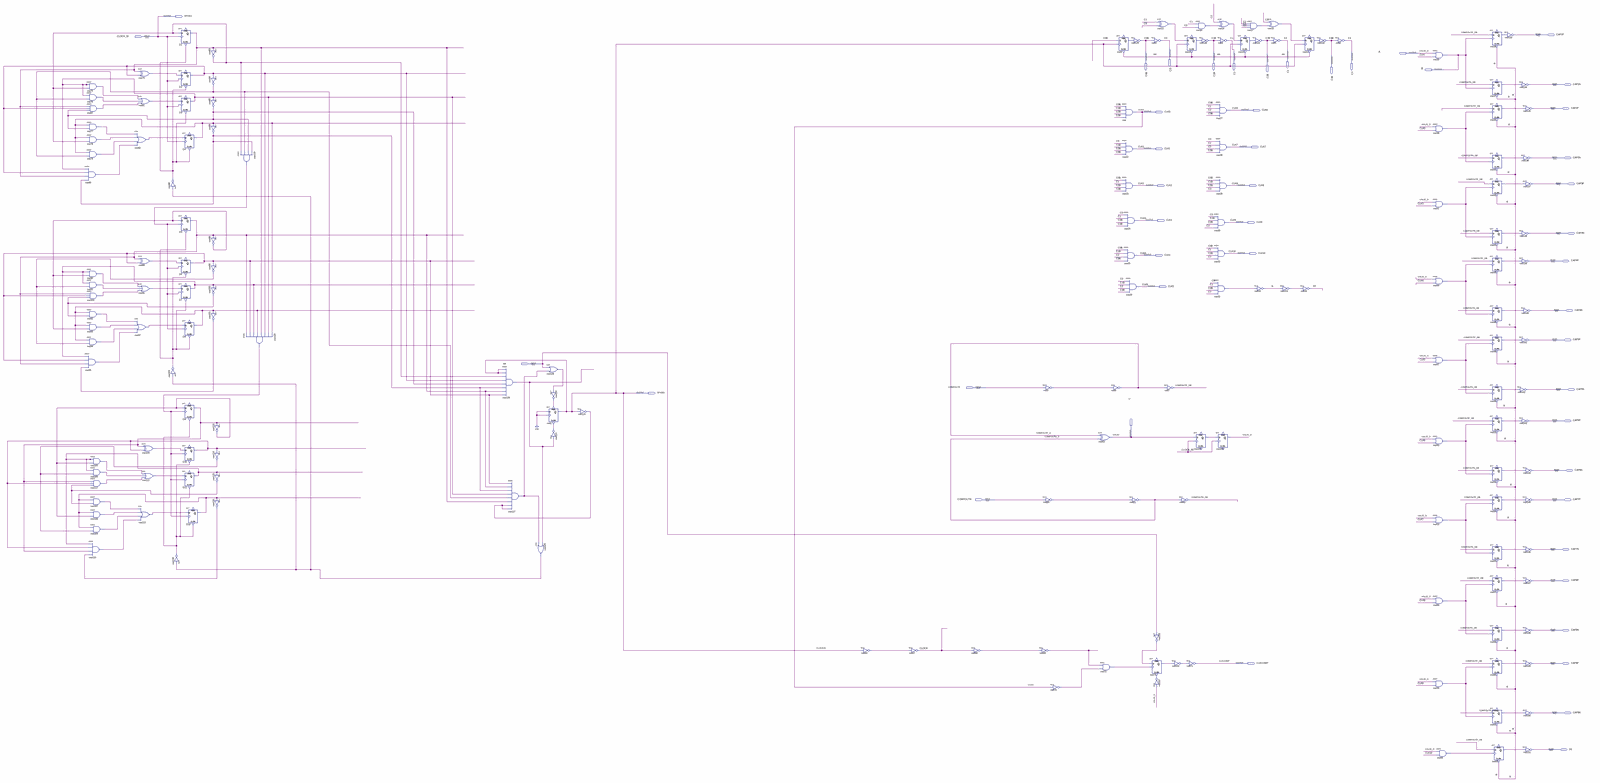
[diagram p0: schematic sheet, whole]
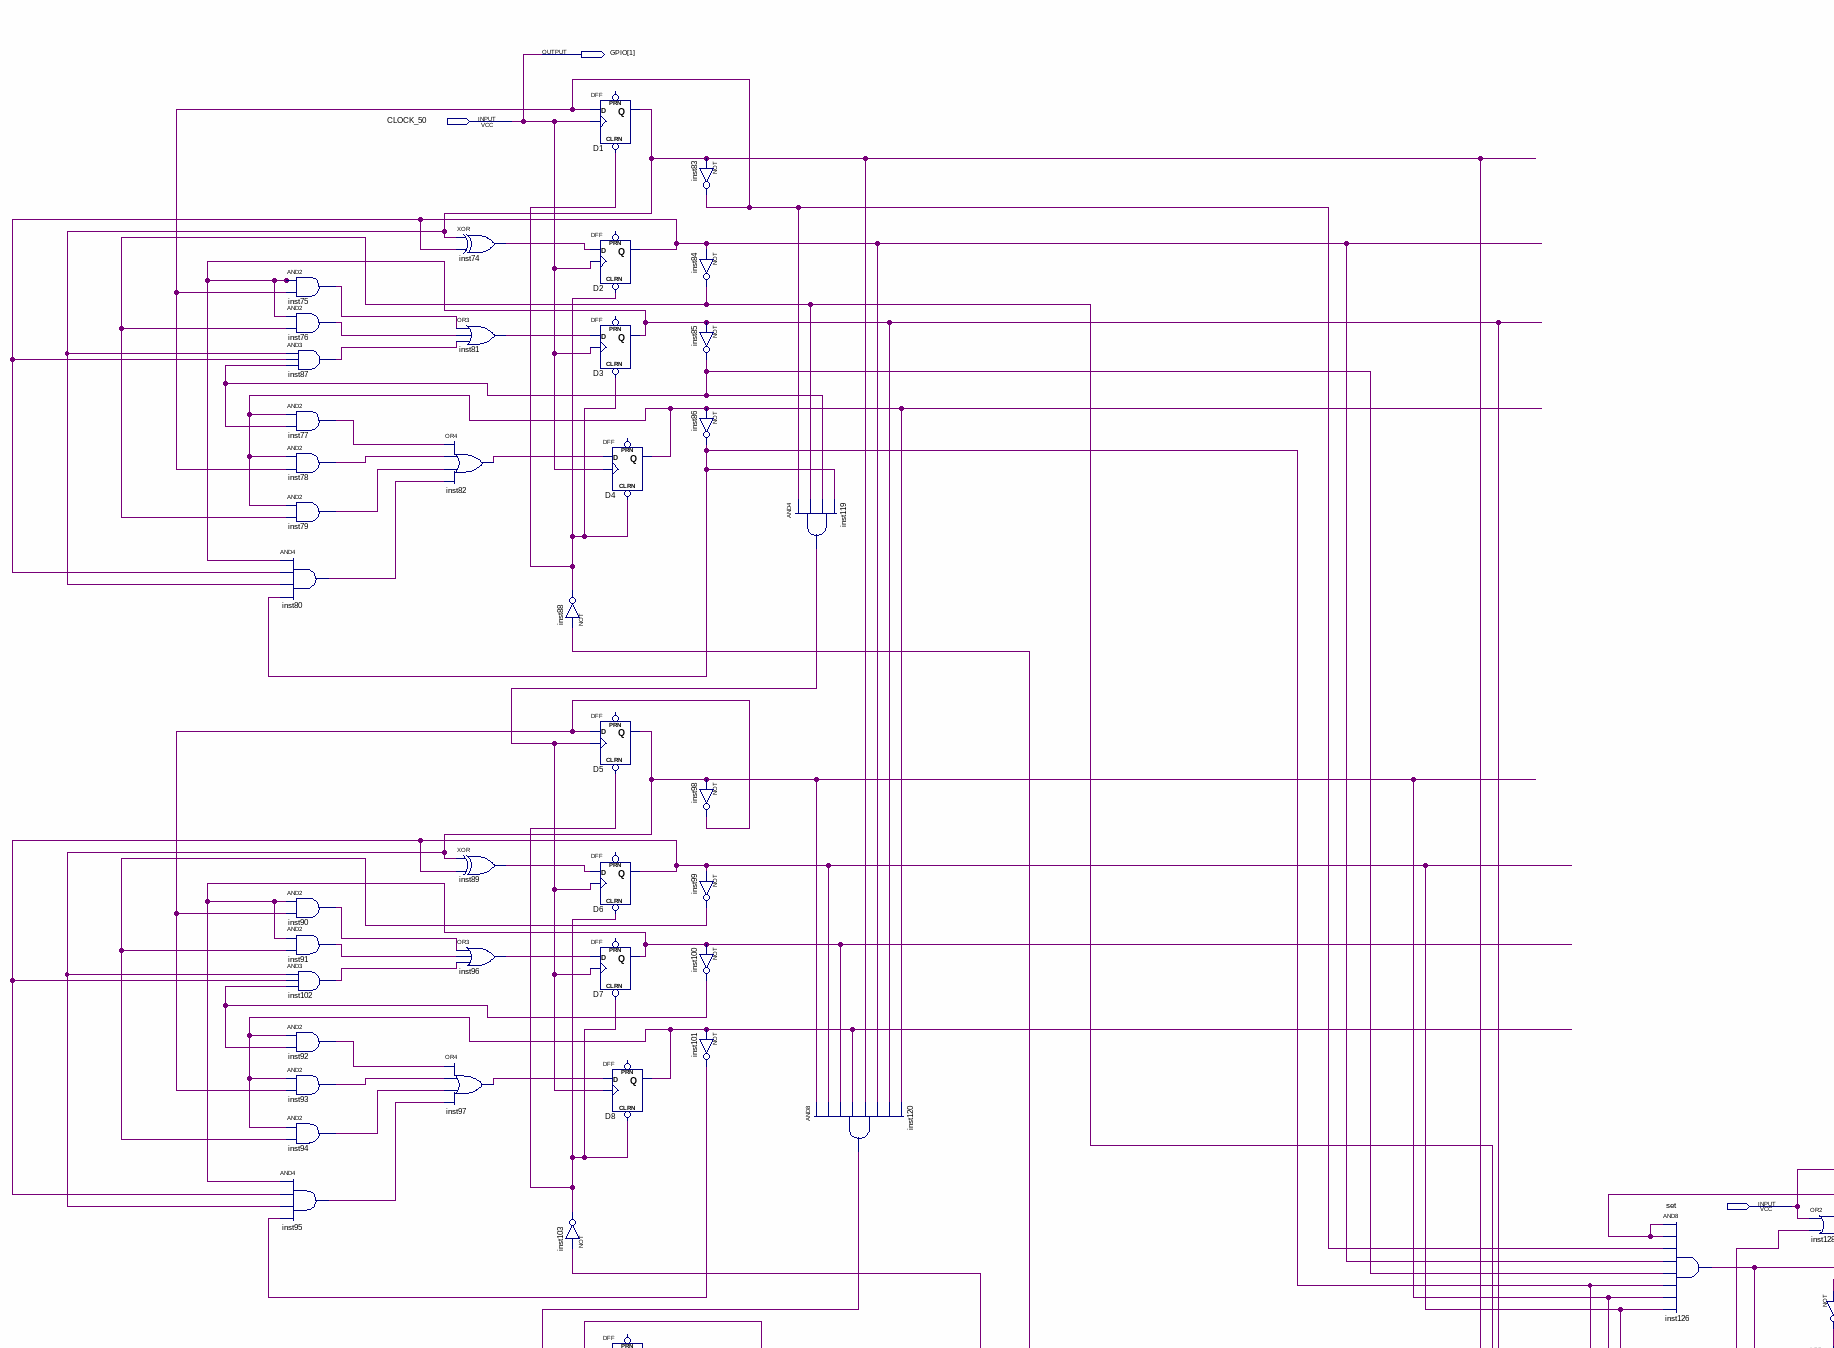
[diagram p1: schematic sheet, upper left part]
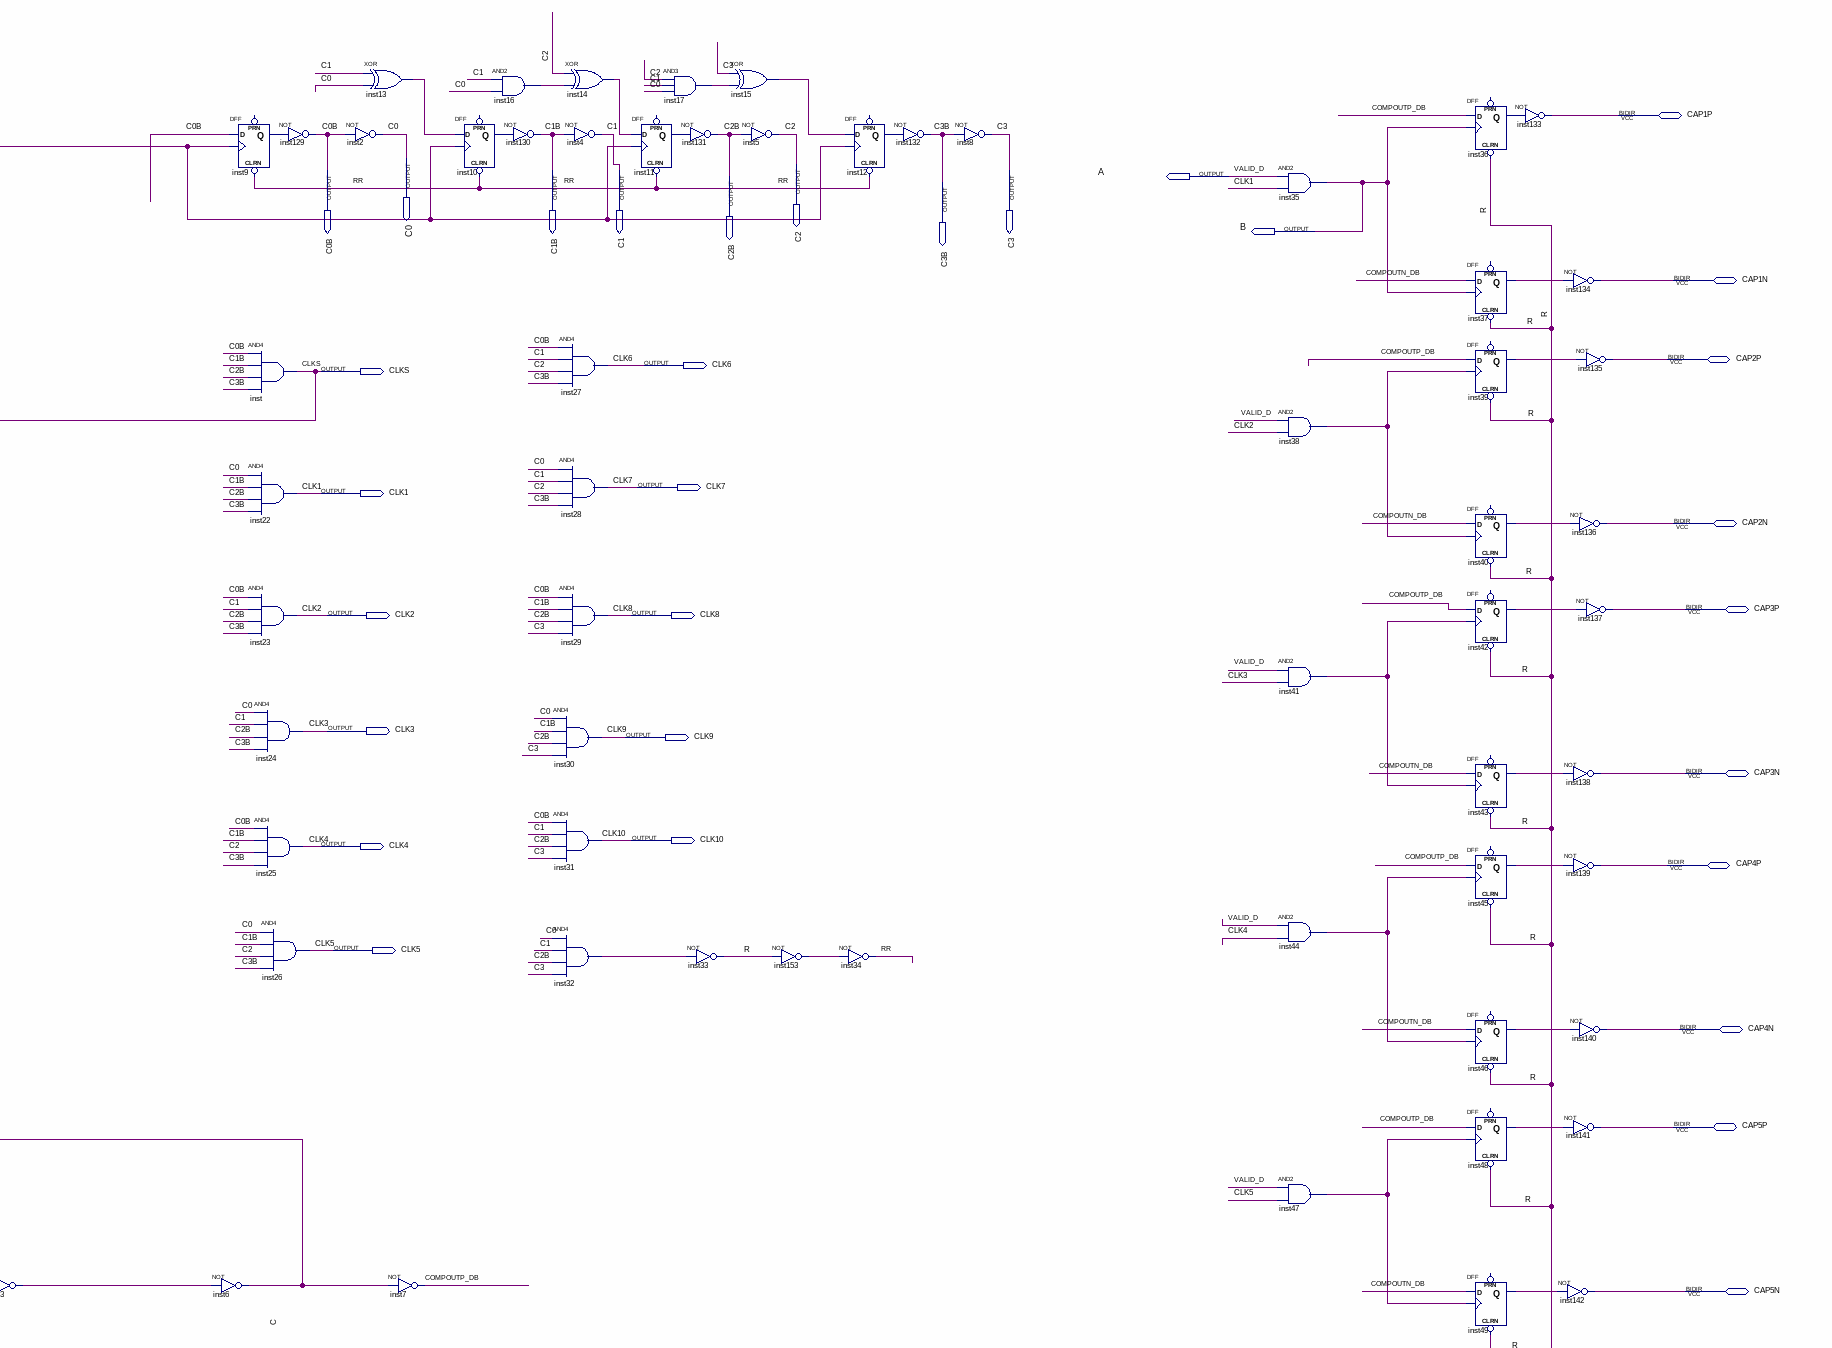
[diagram p2: schematic sheet, upper right part]
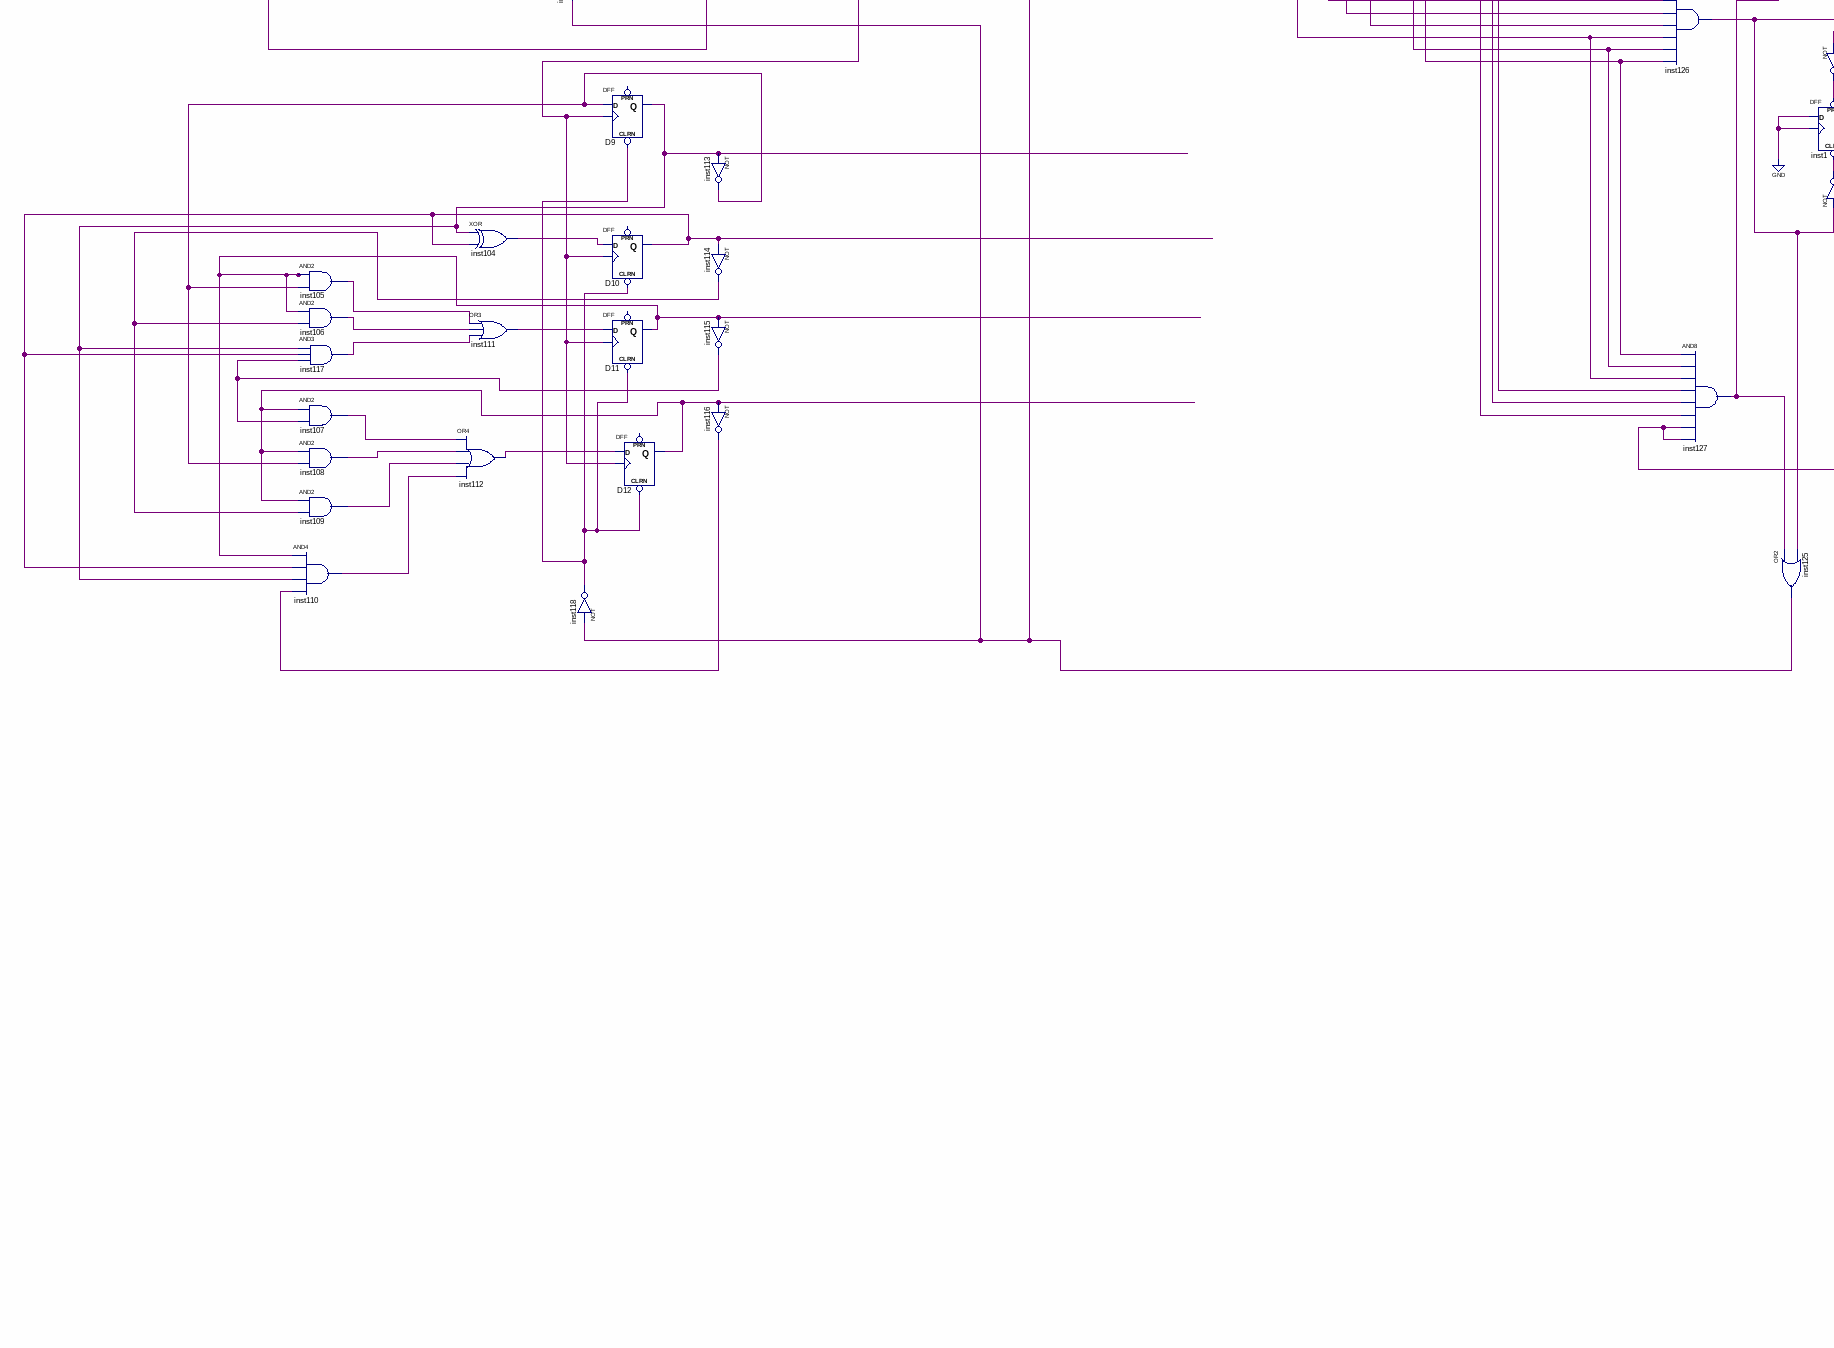
[diagram p3: schematic sheet, lower left part]
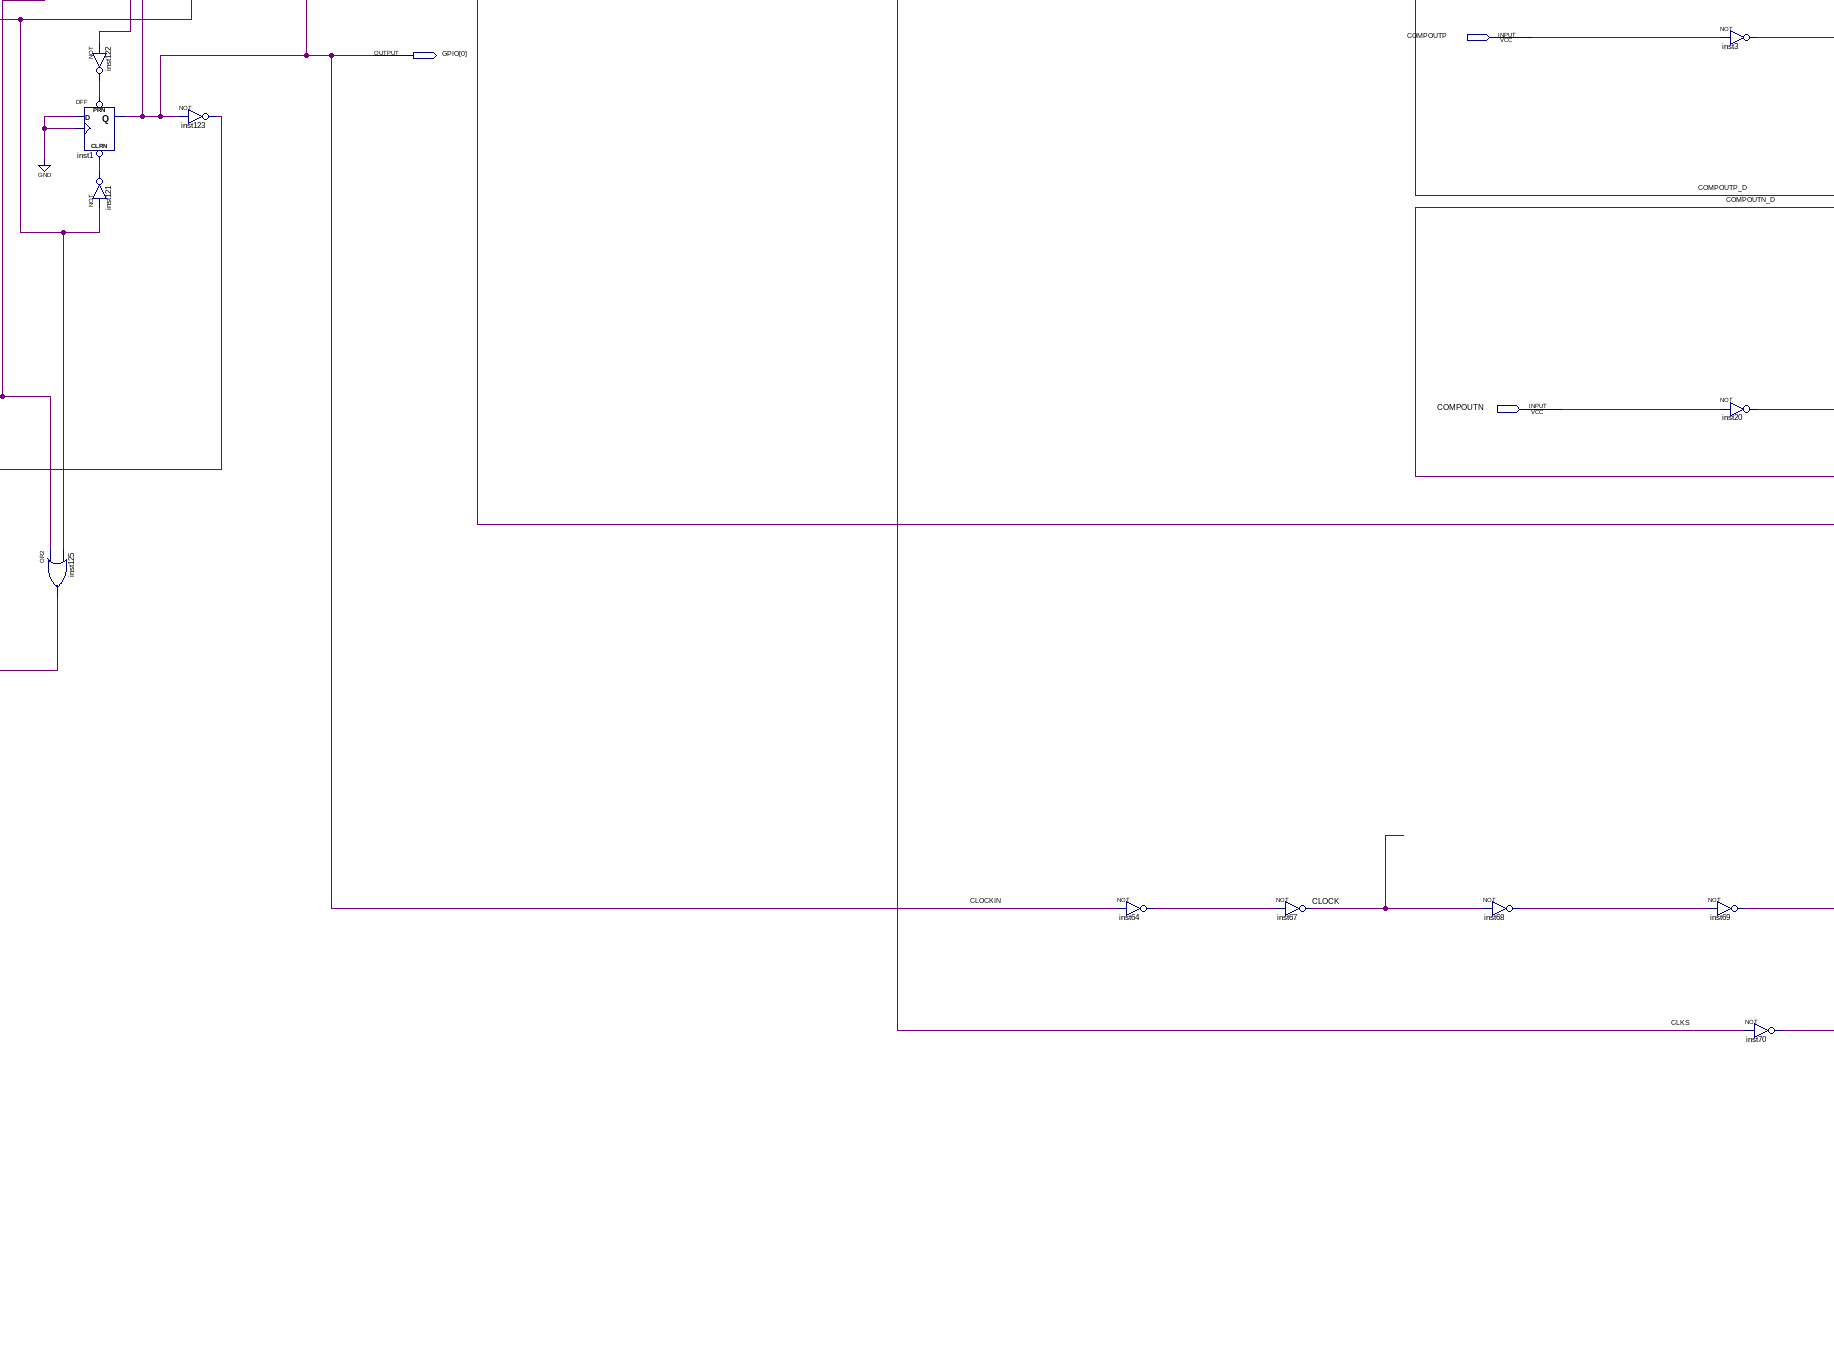
[diagram p4: schematic sheet, lower centre part]
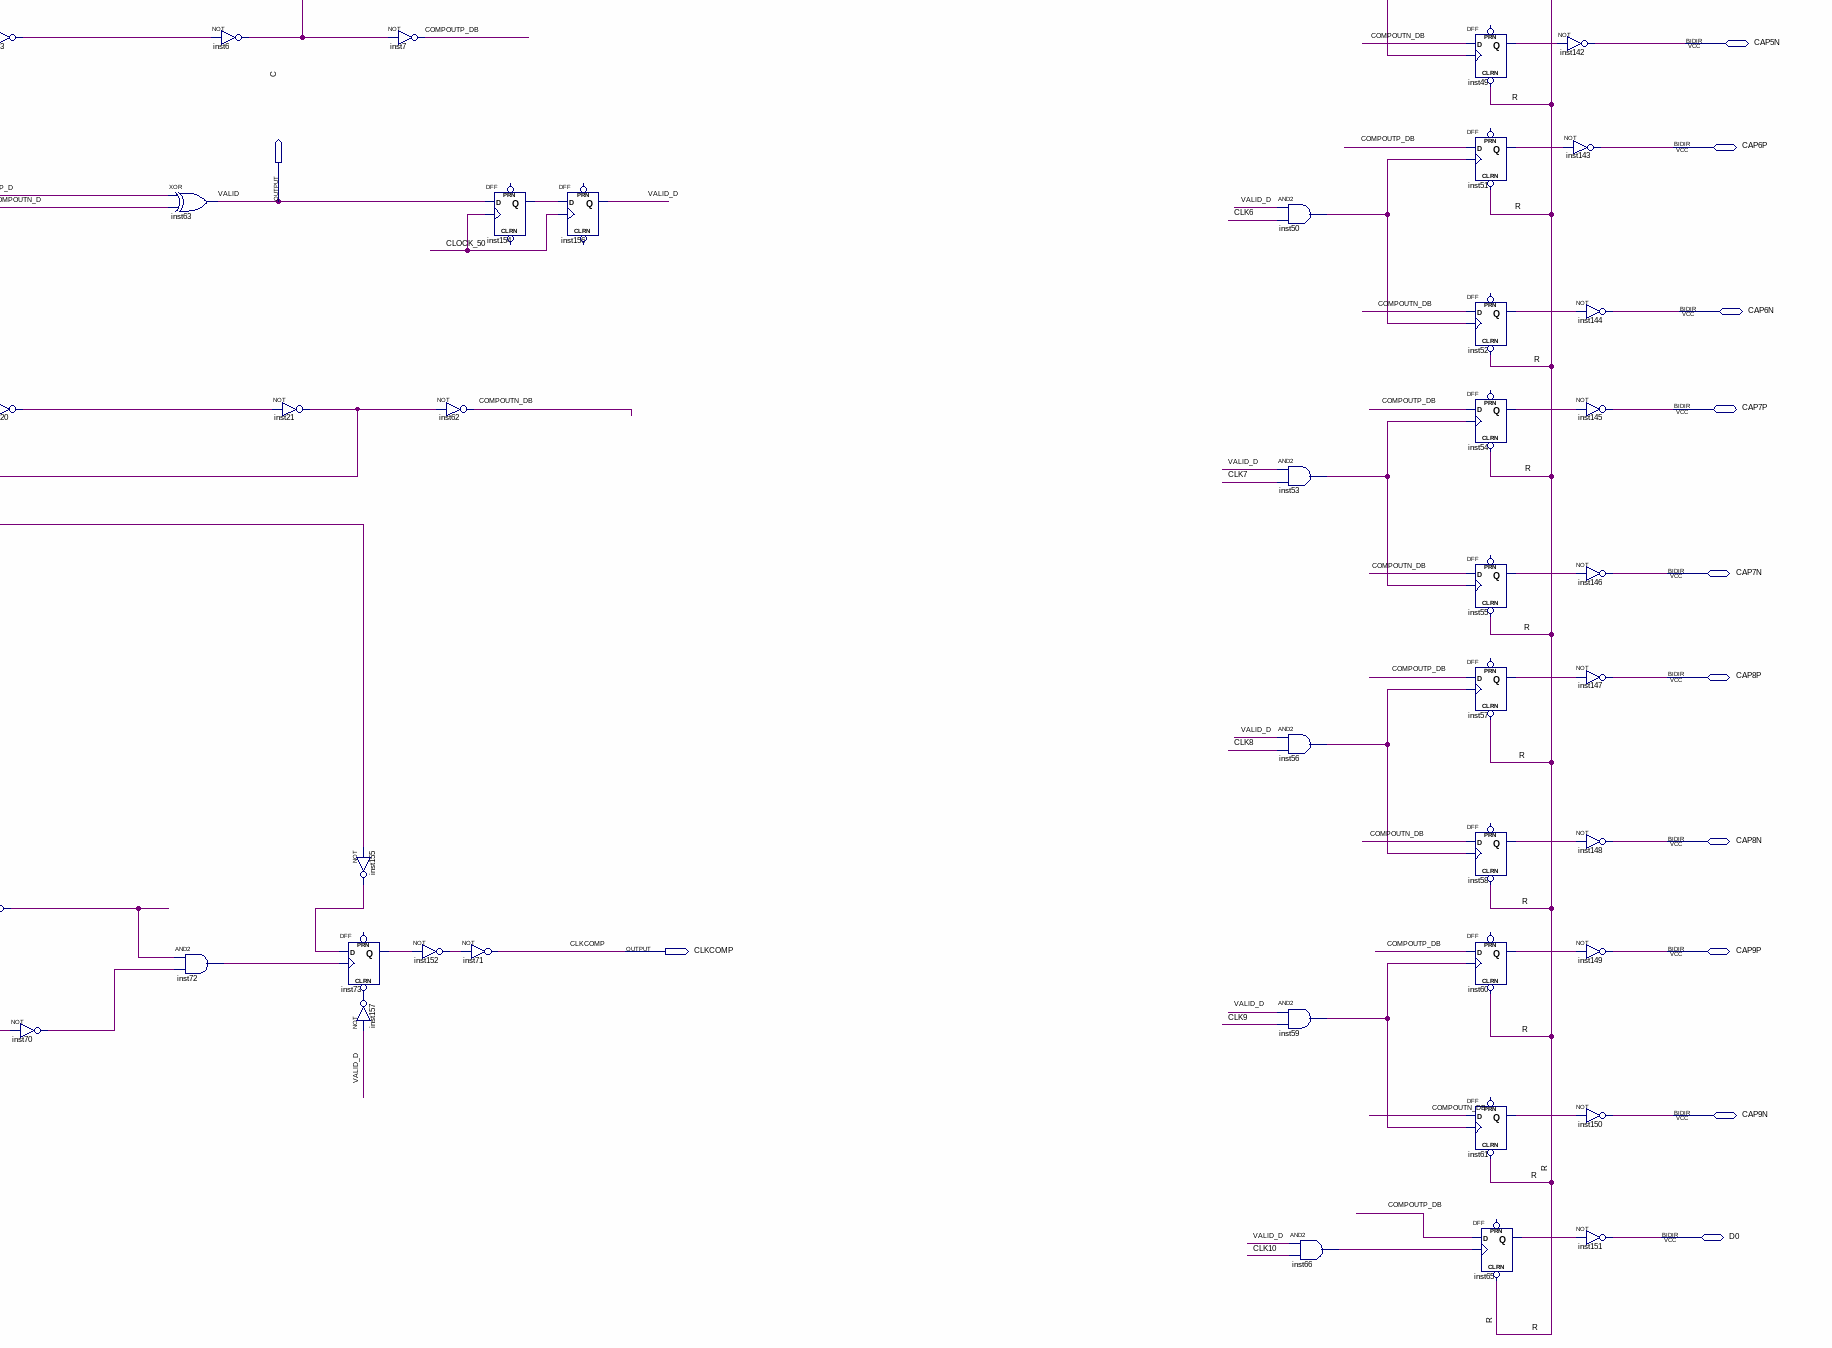
[diagram p5: schematic sheet, lower right part]
// Quartus schematic project_circuit.bdf as structural Verilog: 167 symbols, 48 pins
module project_circuit (
  input  CLOCK_50,
  input  set,
  input  COMPOUTP,
  input  COMPOUTN,
  inout  CAP1P,
  inout  CAP1N,
  inout  CAP2P,
  inout  CAP2N,
  inout  CAP3P,
  inout  CAP3N,
  inout  CAP4P,
  inout  CAP4N,
  inout  CAP5P,
  inout  CAP5N,
  inout  CAP6P,
  inout  CAP6N,
  inout  CAP7P,
  inout  CAP7N,
  inout  CAP8P,
  inout  CAP8N,
  inout  CAP9P,
  inout  CAP9N,
  inout  D0,
  output [1:0] GPIO,
  output C0,
  output C2,
  output C0B,
  output C1B,
  output C1,
  output C3,
  output C2B,
  output A,
  output C3B,
  output B,
  output CLK6,
  output CLKS,
  output CLK7,
  output CLK1,
  output CLK2,
  output CLK8,
  output CLK3,
  output CLK9,
  output CLK10,
  output CLK4,
  output CLK5,
  output C,
  output CLKCOMP
);

  wire CLOCK, COMPOUTN_D, COMPOUTN_DB, COMPOUTP_D, COMPOUTP_DB, D1_q, D2_q, D3_q, D4_q, D5_q, D6_q, D7_q,
       D8_q, D9_q, D10_q, D11_q, D12_q, inst3_out, inst9_q, inst10_q, inst11_q, inst12_q, inst13_out,
       inst14_out, inst15_out, inst16_out, inst17_out, inst20_out, inst32_out, inst36_q, inst37_q,
       inst38_out, inst39_q, inst40_q, inst41_out, inst42_q, inst43_q, inst44_out, inst45_q, inst46_q,
       inst47_out, inst48_q, inst49_q, inst50_out, inst51_q, inst52_q, inst53_out, inst54_q, inst55_q,
       inst56_out, inst57_q, inst58_q, inst59_out, inst60_q, inst61_q, inst64_out, inst65_q, inst66_out,
       inst68_out, inst69_out, inst70_out, inst72_out, inst73_q, inst74_out, inst75_out, inst76_out,
       inst77_out, inst78_out, inst79_out, inst80_out, inst81_out, inst82_out, inst83_out, inst84_out,
       inst85_out, inst86_out, inst87_out, inst88_out, inst89_out, inst90_out, inst91_out, inst92_out,
       inst93_out, inst94_out, inst95_out, inst96_out, inst97_out, inst98_out, inst99_out, inst100_out,
       inst101_out, inst102_out, inst103_out, inst104_out, inst105_out, inst106_out, inst107_out,
       inst108_out, inst109_out, inst110_out, inst111_out, inst112_out, inst113_out, inst114_out,
       inst115_out, inst116_out, inst117_out, inst118_out, inst119_out, inst120_out, inst121_out,
       inst122_out, inst123_out, inst125_out, inst126_out, inst127_out, inst128_out, inst152_out,
       inst153_out, inst154_q, inst155_out, inst157_out, R, RR;

  and inst75 (inst75_out, D3_q, inst83_out);
  and inst76 (inst76_out, D3_q, inst84_out);
  and inst87 (inst87_out, D1_q, D2_q, inst85_out);
  and inst77 (inst77_out, D4_q, inst85_out);
  and inst78 (inst78_out, D4_q, inst83_out);
  and inst79 (inst79_out, D4_q, inst84_out);
  and inst80 (inst80_out, D3_q, D2_q, D1_q, inst86_out);
  and inst90 (inst90_out, D7_q, inst98_out);
  and inst91 (inst91_out, D7_q, inst99_out);
  and inst102 (inst102_out, D5_q, D6_q, inst100_out);
  and inst92 (inst92_out, D8_q, inst100_out);
  and inst93 (inst93_out, D8_q, inst98_out);
  and inst94 (inst94_out, D8_q, inst99_out);
  and inst95 (inst95_out, D7_q, D6_q, D5_q, inst101_out);
  and inst110 (inst110_out, D11_q, D10_q, D9_q, inst116_out);
  and inst105 (inst105_out, D11_q, inst113_out);
  and inst106 (inst106_out, D11_q, inst114_out);
  and inst117 (inst117_out, D9_q, D10_q, inst115_out);
  and inst107 (inst107_out, D12_q, inst115_out);
  and inst108 (inst108_out, D12_q, inst113_out);
  and inst109 (inst109_out, D12_q, inst114_out);
  xor inst74 (inst74_out, D1_q, D2_q);
  or inst81 (inst81_out, inst75_out, inst76_out, inst87_out);
  or inst82 (inst82_out, inst77_out, inst78_out, inst79_out, inst80_out);
  xor inst89 (inst89_out, D5_q, D6_q);
  or inst96 (inst96_out, inst90_out, inst91_out, inst102_out);
  or inst97 (inst97_out, inst92_out, inst93_out, inst94_out, inst95_out);
  xor inst104 (inst104_out, D9_q, D10_q);
  or inst111 (inst111_out, inst105_out, inst106_out, inst117_out);
  or inst112 (inst112_out, inst107_out, inst108_out, inst109_out, inst110_out);
  not inst88 (inst88_out, inst125_out);
  not inst103 (inst103_out, inst125_out);
  not inst118 (inst118_out, inst125_out);
  DFF D1 (.CLRN(inst88_out), .CLK(CLOCK_50), .D(inst83_out), .Q(D1_q));  // open: PRN
  DFF D2 (.CLRN(inst88_out), .CLK(CLOCK_50), .D(inst74_out), .Q(D2_q));  // open: PRN
  DFF D3 (.CLRN(inst88_out), .CLK(CLOCK_50), .D(inst81_out), .Q(D3_q));  // open: PRN
  DFF D4 (.CLRN(inst88_out), .CLK(CLOCK_50), .D(inst82_out), .Q(D4_q));  // open: PRN
  DFF D5 (.CLRN(inst103_out), .CLK(inst119_out), .D(inst98_out), .Q(D5_q));  // open: PRN
  DFF D6 (.CLRN(inst103_out), .CLK(inst119_out), .D(inst89_out), .Q(D6_q));  // open: PRN
  DFF D7 (.CLRN(inst103_out), .CLK(inst119_out), .D(inst96_out), .Q(D7_q));  // open: PRN
  DFF D8 (.CLRN(inst103_out), .CLK(inst119_out), .D(inst97_out), .Q(D8_q));  // open: PRN
  DFF D9 (.CLRN(inst118_out), .CLK(inst120_out), .D(inst113_out), .Q(D9_q));  // open: PRN
  DFF D10 (.CLRN(inst118_out), .CLK(inst120_out), .D(inst104_out), .Q(D10_q));  // open: PRN
  DFF D11 (.CLRN(inst118_out), .CLK(inst120_out), .D(inst111_out), .Q(D11_q));  // open: PRN
  DFF D12 (.CLRN(inst118_out), .CLK(inst120_out), .D(inst112_out), .Q(D12_q));  // open: PRN
  not inst83 (inst83_out, D1_q);
  not inst84 (inst84_out, D2_q);
  not inst85 (inst85_out, D3_q);
  not inst86 (inst86_out, D4_q);
  not inst98 (inst98_out, D5_q);
  not inst99 (inst99_out, D6_q);
  not inst100 (inst100_out, D7_q);
  not inst101 (inst101_out, D8_q);
  not inst113 (inst113_out, D9_q);
  not inst114 (inst114_out, D10_q);
  not inst115 (inst115_out, D11_q);
  not inst116 (inst116_out, D12_q);
  and inst119 (inst119_out, inst83_out, inst84_out, inst85_out, inst86_out);
  and inst120 (inst120_out, D5_q, D6_q, D7_q, D8_q, D1_q, D2_q, D3_q, D4_q);
  and inst126 (inst126_out, GPIO[0], GPIO[0], inst83_out, D2_q, inst85_out, inst86_out, D5_q, D6_q);
  and inst127 (inst127_out, D6_q, D5_q, inst86_out, D3_q, inst84_out, D1_q, inst123_out, inst123_out);
  or inst125 (inst125_out, inst127_out, inst126_out);
  or inst128 (inst128_out, set, inst127_out);
  not inst122 (inst122_out, inst128_out);
  DFF inst1 (.CLRN(inst121_out), .CLK(1'b0), .D(1'b0), .PRN(inst122_out), .Q(GPIO[0]));
  not inst121 (inst121_out, inst126_out);
  not inst123 (inst123_out, GPIO[0]);
  not inst64 (inst64_out, GPIO[0]);
  not inst67 (CLOCK, inst64_out);
  not inst68 (inst68_out, CLOCK);
  not inst3 (inst3_out, COMPOUTP);
  not inst20 (inst20_out, COMPOUTN);
  not inst69 (inst69_out, inst68_out);
  not inst70 (inst70_out, CLKS);
  xor inst63 (C, COMPOUTP_D, COMPOUTN_D);
  and inst72 (inst72_out, inst69_out, inst70_out);
  DFF inst9 (.CLRN(RR), .CLK(GPIO[0]), .D(C0B), .Q(inst9_q));  // open: PRN
  not inst6 (COMPOUTP_D, inst3_out);
  not inst129 (C0B, inst9_q);
  and inst (CLKS, C0B, C1B, C2B, C3B);
  and inst22 (CLK1, C0, C1B, C2B, C3B);
  and inst23 (CLK2, C0B, C1, C2B, C3B);
  and inst24 (CLK3, C0, C1, C2B, C3B);
  and inst25 (CLK4, C0B, C1B, C2, C3B);
  and inst26 (CLK5, C0, C1B, C2, C3B);
  not inst21 (COMPOUTN_D, inst20_out);
  xor inst13 (inst13_out, C1, C0);
  not inst2 (C0, C0B);
  not inst155 (inst155_out, set);
  DFF inst73 (.CLRN(inst157_out), .CLK(inst72_out), .D(inst155_out), .Q(inst73_q));  // open: PRN
  not inst157 (inst157_out, A);
  not inst7 (COMPOUTP_DB, COMPOUTP_D);
  not inst152 (inst152_out, inst73_q);
  DFF inst10 (.CLRN(RR), .CLK(GPIO[0]), .D(inst13_out), .Q(inst10_q));  // open: PRN
  not inst62 (COMPOUTN_DB, COMPOUTN_D);
  not inst71 (CLKCOMP, inst152_out);
  and inst16 (inst16_out, C1, C0);
  not inst130 (C1B, inst10_q);
  DFF inst154 (.CLK(CLOCK_50), .D(C), .Q(inst154_q));  // open: CLRN, PRN
  xor inst14 (inst14_out, C2, inst16_out);
  not inst4 (C1, C1B);
  and inst27 (CLK6, C0B, C1, C2, C3B);
  and inst28 (CLK7, C0, C1, C2, C3B);
  and inst29 (CLK8, C0B, C1B, C2B, C3);
  and inst30 (CLK9, C0, C1B, C2B, C3);
  and inst31 (CLK10, C0B, C1, C2B, C3);
  and inst32 (inst32_out, C0, C1, C2B, C3);
  DFF inst156 (.CLK(CLOCK_50), .D(inst154_q), .Q(A));  // open: CLRN, PRN
  and inst17 (inst17_out, C2, C1, C0);
  DFF inst11 (.CLRN(RR), .CLK(GPIO[0]), .D(inst14_out), .Q(inst11_q));  // open: PRN
  not inst131 (C2B, inst11_q);
  not inst33 (R, inst32_out);
  xor inst15 (inst15_out, C3, inst17_out);
  not inst5 (C2, C2B);
  not inst153 (inst153_out, R);
  DFF inst12 (.CLRN(RR), .CLK(GPIO[0]), .D(inst15_out), .Q(inst12_q));  // open: PRN
  not inst34 (RR, inst153_out);
  not inst132 (C3B, inst12_q);
  not inst8 (C3, C3B);
  and inst35 (B, A, CLK1);
  and inst38 (inst38_out, A, CLK2);
  and inst41 (inst41_out, A, CLK3);
  and inst44 (inst44_out, A, CLK4);
  and inst47 (inst47_out, A, CLK5);
  and inst50 (inst50_out, A, CLK6);
  and inst53 (inst53_out, A, CLK7);
  and inst56 (inst56_out, A, CLK8);
  and inst59 (inst59_out, A, CLK9);
  and inst66 (inst66_out, A, CLK10);
  DFF inst36 (.CLRN(R), .CLK(B), .D(COMPOUTP_DB), .Q(inst36_q));  // open: PRN
  DFF inst37 (.CLRN(R), .CLK(B), .D(COMPOUTN_DB), .Q(inst37_q));  // open: PRN
  DFF inst39 (.CLRN(R), .CLK(inst38_out), .D(COMPOUTP_DB), .Q(inst39_q));  // open: PRN
  DFF inst40 (.CLRN(R), .CLK(inst38_out), .D(COMPOUTN_DB), .Q(inst40_q));  // open: PRN
  DFF inst42 (.CLRN(R), .CLK(inst41_out), .D(COMPOUTP_DB), .Q(inst42_q));  // open: PRN
  DFF inst43 (.CLRN(R), .CLK(inst41_out), .D(COMPOUTN_DB), .Q(inst43_q));  // open: PRN
  DFF inst45 (.CLRN(R), .CLK(inst44_out), .D(COMPOUTP_DB), .Q(inst45_q));  // open: PRN
  DFF inst46 (.CLRN(R), .CLK(inst44_out), .D(COMPOUTN_DB), .Q(inst46_q));  // open: PRN
  DFF inst48 (.CLRN(R), .CLK(inst47_out), .D(COMPOUTP_DB), .Q(inst48_q));  // open: PRN
  DFF inst49 (.CLRN(R), .CLK(inst47_out), .D(COMPOUTN_DB), .Q(inst49_q));  // open: PRN
  DFF inst51 (.CLRN(R), .CLK(inst50_out), .D(COMPOUTP_DB), .Q(inst51_q));  // open: PRN
  DFF inst52 (.CLRN(R), .CLK(inst50_out), .D(COMPOUTN_DB), .Q(inst52_q));  // open: PRN
  DFF inst54 (.CLRN(R), .CLK(inst53_out), .D(COMPOUTP_DB), .Q(inst54_q));  // open: PRN
  DFF inst55 (.CLRN(R), .CLK(inst53_out), .D(COMPOUTN_DB), .Q(inst55_q));  // open: PRN
  DFF inst57 (.CLRN(R), .CLK(inst56_out), .D(COMPOUTP_DB), .Q(inst57_q));  // open: PRN
  DFF inst58 (.CLRN(R), .CLK(inst56_out), .D(COMPOUTN_DB), .Q(inst58_q));  // open: PRN
  DFF inst60 (.CLRN(R), .CLK(inst59_out), .D(COMPOUTP_DB), .Q(inst60_q));  // open: PRN
  DFF inst61 (.CLRN(R), .CLK(inst59_out), .D(COMPOUTN_DB), .Q(inst61_q));  // open: PRN
  DFF inst65 (.CLRN(R), .CLK(inst66_out), .D(COMPOUTP_DB), .Q(inst65_q));  // open: PRN
  not inst133 (CAP1P, inst36_q);
  not inst134 (CAP1N, inst37_q);
  not inst135 (CAP2P, inst39_q);
  not inst136 (CAP2N, inst40_q);
  not inst137 (CAP3P, inst42_q);
  not inst138 (CAP3N, inst43_q);
  not inst139 (CAP4P, inst45_q);
  not inst140 (CAP4N, inst46_q);
  not inst141 (CAP5P, inst48_q);
  not inst142 (CAP5N, inst49_q);
  not inst143 (CAP6P, inst51_q);
  not inst144 (CAP6N, inst52_q);
  not inst145 (CAP7P, inst54_q);
  not inst146 (CAP7N, inst55_q);
  not inst147 (CAP8P, inst57_q);
  not inst148 (CAP8N, inst58_q);
  not inst149 (CAP9P, inst60_q);
  not inst150 (CAP9N, inst61_q);
  not inst151 (D0, inst65_q);

  assign GPIO[1] = CLOCK_50;

  // Other names for the same wires on the sheet: CLOCKIN = GPIO[0]; VALID = C; VALID_D = A
endmodule
